# Altium schematic sheet IMU_ATM_Module.SchDoc: IMU/Atm. Sensor Module
size A4; DrawnBy: Samyar Sadat Akhavi; Revision: 1.0; SheetNumber: 1; SheetTotal: 3
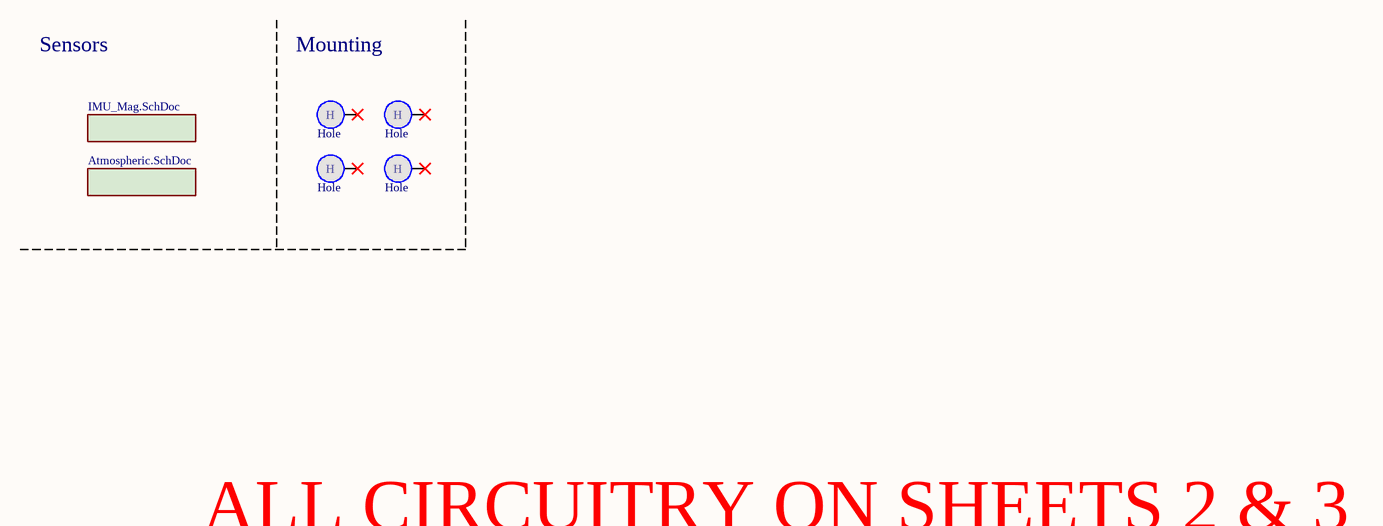
[diagram p0: IMU_ATM_Module.SchDoc]

## Parts
?  (no value)  (graphical)
Hole1  Hole  [Hole_2mm]  (no BOM)
Hole2  Hole  [Hole_2mm]  (no BOM)
Hole3  Hole  [Hole_2mm]  (no BOM)
Hole4  Hole  [Hole_2mm]  (no BOM)

## Sub-sheets
ATM_SENS = Atmospheric.SchDoc: no entries
IMU_SENS = IMU_Mag.SchDoc: no entries

## Nets

Not connected (* = marked no-connect by the designer): Hole1 1*; Hole2 1*; Hole3 1*; Hole4 1*

## Notes on the sheet
- Sensors
- Mounting
- ALL CIRCUITRY ON SHEETS 2 & 3
- Sub-Project:
- Size:
- Drawn By:
- Revision:
- Date:
- File:
- Sheet:
- of
- (in symbol Hole) H

## Library data of the parts
? = Standard Title Block